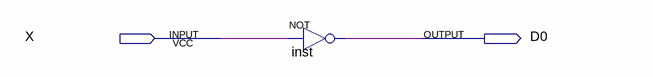
[diagram p0: schematic sheet]
// Quartus schematic D0.bdf as structural Verilog: 1 symbols, 2 pins
module D0 (
  input  X,
  output D0
);

  not inst (D0, X);
endmodule
